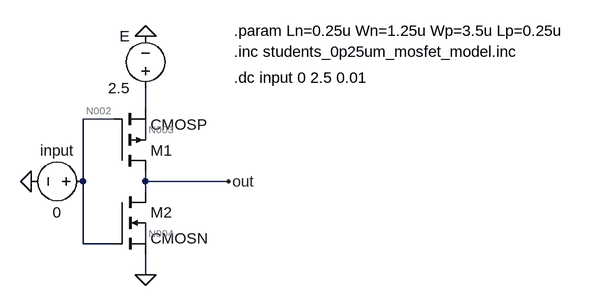
[diagram p0: schematic invertor_check.asc]
invertor_check.asc, the LTspice schematic file:
Version 4
SHEET 1 880 680
WIRE 160 -192 160 -224
WIRE 112 -176 64 -176
WIRE 160 -144 160 -176
WIRE 64 -80 64 -176
WIRE 160 -80 160 -96
WIRE 288 -80 160 -80
WIRE 160 -64 160 -80
WIRE 64 16 64 -80
WIRE 112 16 64 16
WIRE 160 16 160 -16
WIRE 160 64 160 32
FLAG 160 64 0
FLAG 288 -80 out
FLAG 160 -304 0
FLAG -16 -80 0
SYMBOL pmos4 112 -96 M180
SYMATTR InstName M1
SYMATTR Value CMOSP
SYMATTR Value2 l=Lp w=Wp
SYMBOL voltage 160 -208 R180
WINDOW 0 24 96 Left 2
WINDOW 3 24 16 Left 2
SYMATTR InstName E
SYMATTR Value 2.5
SYMBOL voltage 80 -80 R90
WINDOW 0 -32 56 VBottom 2
WINDOW 3 32 56 VTop 2
SYMATTR InstName input
SYMATTR Value 0
SYMBOL nmos4 112 -64 R0
SYMATTR InstName M2
SYMATTR Value CMOSN
SYMATTR Value2 l=Ln w=Wn
TEXT 296 -312 Left 2 !.param Ln=0.25u Wn=1.25u Wp=3.5u Lp=0.25u
TEXT 296 -280 Left 2 !.inc students_0p25um_mosfet_model.inc
TEXT 296 -240 Left 2 !.dc input 0 2.5 0.01

The netlist it stands for:
* invertor_check.asc
M1 out N002 N001 N003 CMOSP l=Lp w=Wp
V§E N001 0 2.5
V§input N002 0 0
M2 out N002 0 N004 CMOSN l=Ln w=Wn
.model NMOS NMOS
.model PMOS PMOS
.lib standard.mos
.param Ln=0.25u Wn=1.25u Wp=3.5u Lp=0.25u
.inc students_0p25um_mosfet_model.inc
.dc input 0 2.5 0.01
.backanno
.end

* Results of the author's LTspice run, read from the files saved beside the schematic
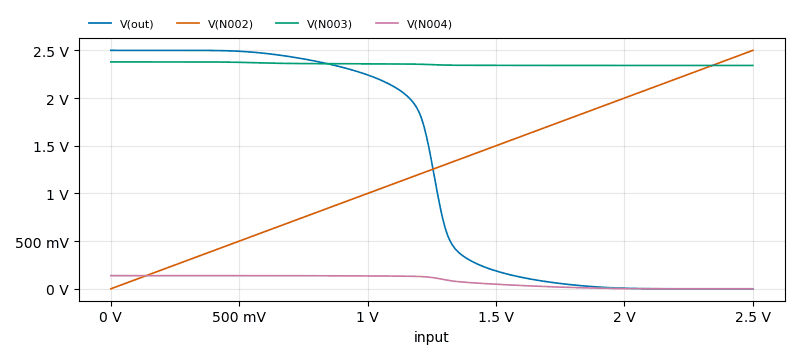
[diagram p1: DC transfer characteristic of invertor_check.asc, plotted from the saved traces]
* DC transfer characteristic, 1 run:
*   V(out): 2.5 V at input=0 V, 55.37 nV at input=2.5 V, min 55.37 nV, max 2.5 V
*   V(N002): 0 V at input=0 V, 2.5 V at input=2.5 V, min 0 V, max 2.5 V
*   V(N003): 2.379 V at input=0 V, 2.342 V at input=2.5 V, min 2.342 V, max 2.379 V
*   V(N004): 138.4 mV at input=0 V, 20.35 nV at input=2.5 V, min 20.35 nV, max 138.4 mV